# EAGLE design motorModule (EAGLE 8.0.2)
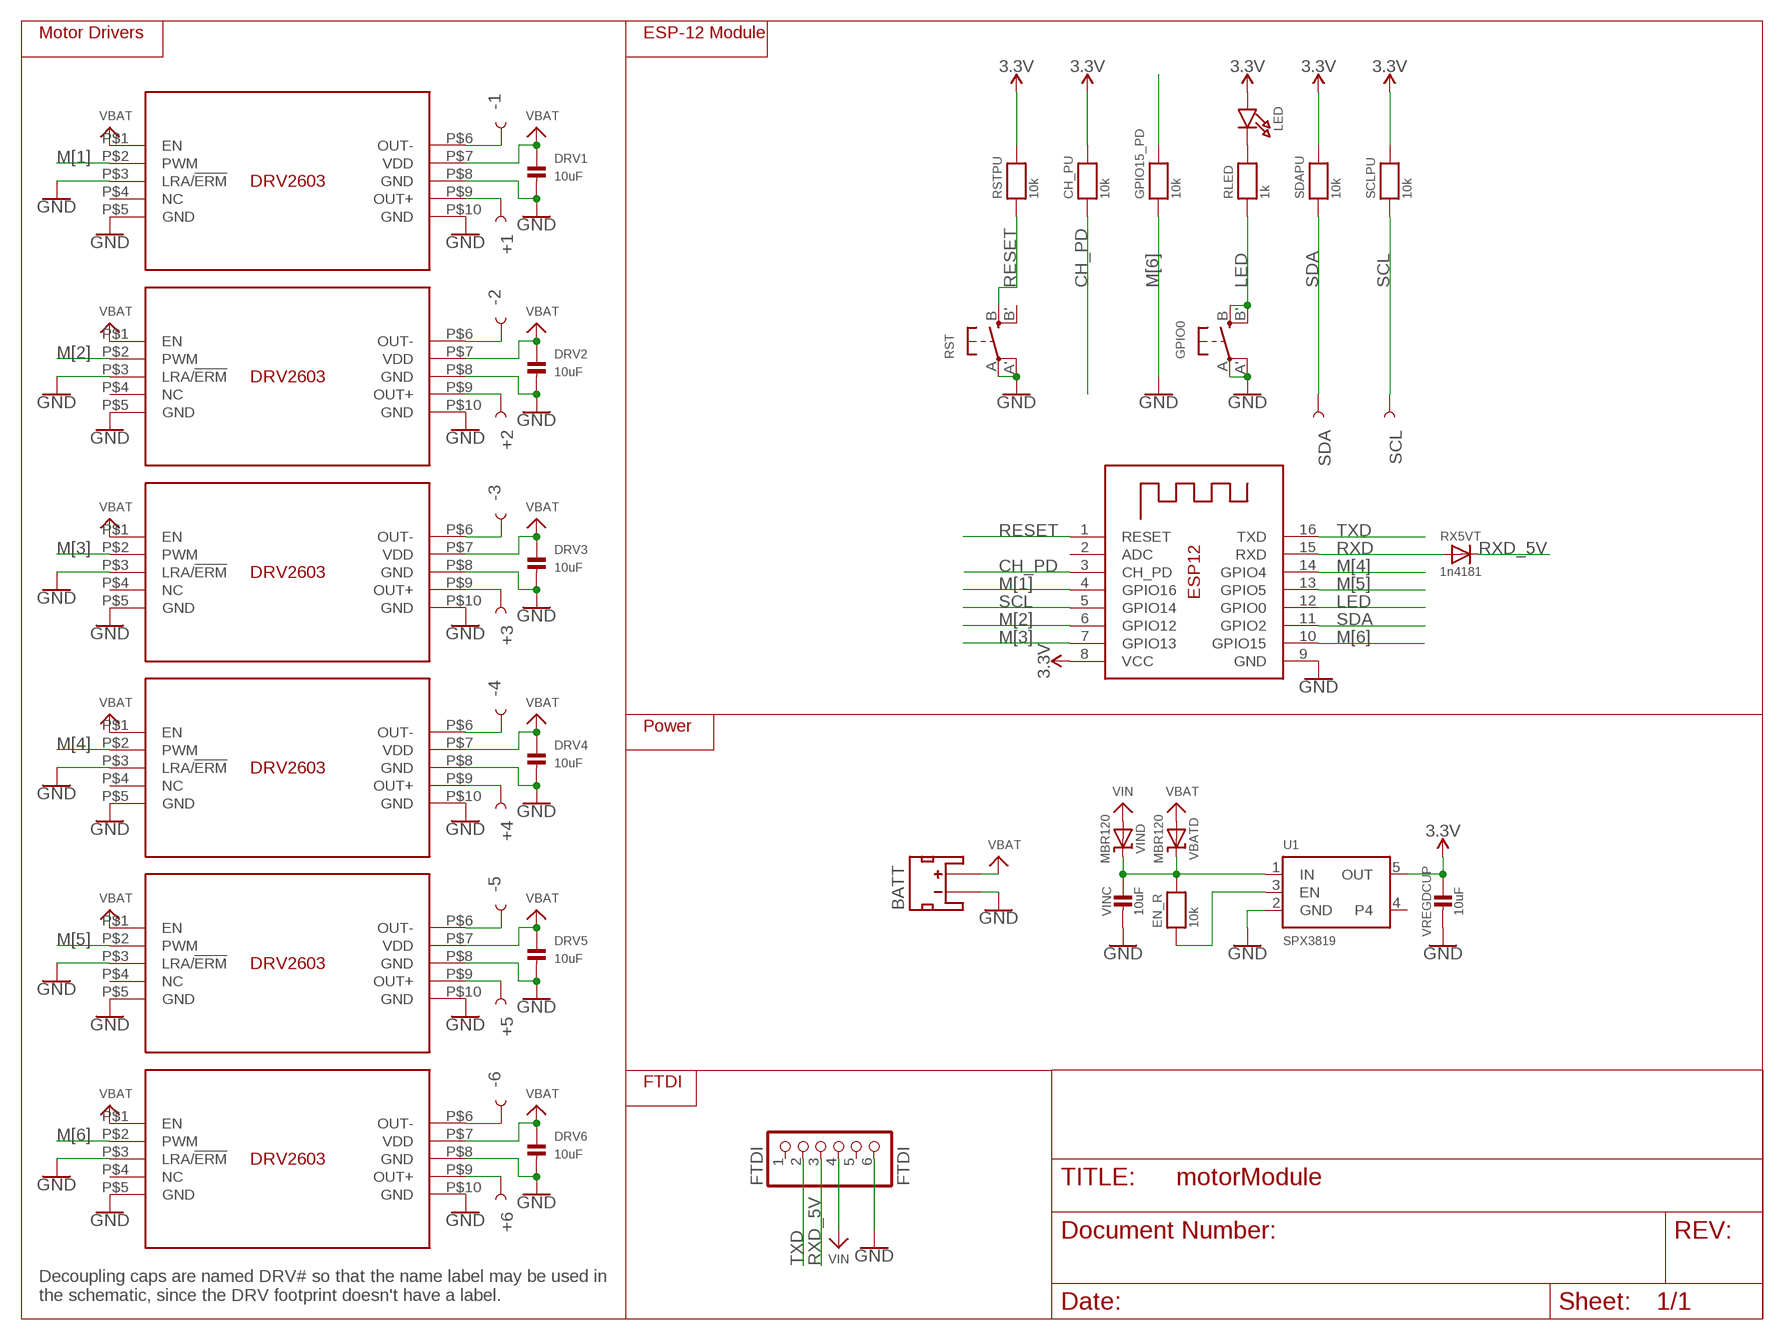
[diagram p0: schematic, sheet 1]

## Parts
+1  SEWTAP_SMALL-2SIDE  [PETAL-SMALL-2SIDE]
+2  SEWTAP_SMALL-2SIDE  [PETAL-SMALL-2SIDE]
+3  SEWTAP_SMALL-2SIDE  [PETAL-SMALL-2SIDE]
+4  SEWTAP_SMALL-2SIDE  [PETAL-SMALL-2SIDE]
+5  SEWTAP_SMALL-2SIDE  [PETAL-SMALL-2SIDE]
+6  SEWTAP_SMALL-2SIDE  [PETAL-SMALL-2SIDE]
-1  SEWTAP_SMALL-2SIDE  [PETAL-SMALL-2SIDE]
-2  SEWTAP_SMALL-2SIDE  [PETAL-SMALL-2SIDE]
-3  SEWTAP_SMALL-2SIDE  [PETAL-SMALL-2SIDE]
-4  SEWTAP_SMALL-2SIDE  [PETAL-SMALL-2SIDE]
-5  SEWTAP_SMALL-2SIDE  [PETAL-SMALL-2SIDE]
-6  SEWTAP_SMALL-2SIDE  [PETAL-SMALL-2SIDE]
BATT  JST_2MM_MALE  [JST-2-SMD]
CH_PU  10k  RESISTOR0603  [0603]
DRV1  10uF  CAP_CERAMIC0603  [0603]
DRV2  10uF  CAP_CERAMIC0603  [0603]
DRV3  10uF  CAP_CERAMIC0603  [0603]
DRV4  10uF  CAP_CERAMIC0603  [0603]
DRV5  10uF  CAP_CERAMIC0603  [0603]
DRV6  10uF  CAP_CERAMIC0603  [0603]
DRVIC1  DRV2603  [DRV2603]
DRVIC2  DRV2603  [DRV2603]
DRVIC3  DRV2603  [DRV2603]
DRVIC4  DRV2603  [DRV2603]
DRVIC5  DRV2603  [DRV2603]
DRVIC6  DRV2603  [DRV2603]
EN_R  10k  RESISTOR0603  [0603]
ESP12  ESP-12  [ESP-12]
FTDI  FTDI  PINHD-1X6  [1X06]
GPIO0  SWITCH_TACT_SMT4.6X2.8  [BTN_KMR2_4.6X2.8]
GPIO15_PD  10k  RESISTOR0603  [0603]
LED  MICROBUILDER_LED0805  [MICROBUILDER_CHIPLED_0805]
RLED  1k  RESISTOR0603  [0603]
RST  SWITCH_TACT_SMT4.6X2.8  [BTN_KMR2_4.6X2.8]
RSTPU  10k  RESISTOR0603  [0603]
RX5VT  1n4181  MICROBUILDER_DIODESOD-323  [MICROBUILDER_SOD-323]
SCL  SEWTAP_SMALL-2SIDE  [PETAL-SMALL-2SIDE]
SCLPU  10k  RESISTOR0603  [0603]
SDA  SEWTAP_SMALL-2SIDE  [PETAL-SMALL-2SIDE]
SDAPU  10k  RESISTOR0603  [0603]
U1  SPX3819  VREG_SOT23-5  [SOT23-5]
VBATD  MBR120  MICROBUILDER_DIODE-SCHOTTKYSOD-123  [MICROBUILDER_SOD-123]
VINC  10uF  MICROBUILDER_CAP_CERAMIC0805-NOOUTLINE  [MICROBUILDER_0805-NO]
VIND  MBR120  MICROBUILDER_DIODE-SCHOTTKYSOD-123  [MICROBUILDER_SOD-123]
VREGDCUP  10uF  MICROBUILDER_CAP_CERAMIC0805-NOOUTLINE  [MICROBUILDER_0805-NO]

## Nets
3.3V: CH_PU.2 ESP12.8(VCC) LED.A RSTPU.2 SCLPU.2 SDAPU.2 U1.5(OUT) VREGDCUP.1
CH_PD: CH_PU.1 ESP12.3(CH_PD)
GND: BATT.1(-) DRV1.2 DRV2.2 DRV3.2 DRV4.2 DRV5.2 DRV6.2 DRVIC1.P$3(LRA/!ERM) DRVIC1.P$5(GND) DRVIC1.P$8(GND) DRVIC1.P$10(GND) DRVIC2.P$3(LRA/!ERM) DRVIC2.P$5(GND) DRVIC2.P$8(GND) DRVIC2.P$10(GND) DRVIC3.P$3(LRA/!ERM) DRVIC3.P$5(GND) DRVIC3.P$8(GND) DRVIC3.P$10(GND) DRVIC4.P$3(LRA/!ERM) DRVIC4.P$5(GND) DRVIC4.P$8(GND) DRVIC4.P$10(GND) DRVIC5.P$3(LRA/!ERM) DRVIC5.P$5(GND) DRVIC5.P$8(GND) DRVIC5.P$10(GND) DRVIC6.P$3(LRA/!ERM) DRVIC6.P$5(GND) DRVIC6.P$8(GND) DRVIC6.P$10(GND) ESP12.9(GND) FTDI.6 GPIO0.A'(P1) GPIO0.A(P) GPIO15_PD.1 RST.A'(P1) RST.A(P) U1.2(GND) VINC.2 VREGDCUP.2
LDO_EN: EN_R.1 U1.3(EN)
LED: ESP12.12(GPIO0) GPIO0.B'(S1) GPIO0.B(S) RLED.1
LEDIN: LED.C RLED.2
M[1]: DRVIC1.P$2(PWM) ESP12.4(GPIO16)
M[2]: DRVIC2.P$2(PWM) ESP12.6(GPIO12)
M[3]: DRVIC3.P$2(PWM) ESP12.7(GPIO13)
M[4]: DRVIC4.P$2(PWM) ESP12.14(GPIO4)
M[5]: DRVIC5.P$2(PWM) ESP12.13(GPIO5)
M[6]: DRVIC6.P$2(PWM) ESP12.10(GPIO15) GPIO15_PD.2
N$4: -1.1 DRVIC1.P$6(OUT-)
N$5: +1.1 DRVIC1.P$9(OUT+)
N$6: -2.1 DRVIC2.P$6(OUT-)
N$7: +2.1 DRVIC2.P$9(OUT+)
N$8: -3.1 DRVIC3.P$6(OUT-)
N$9: +3.1 DRVIC3.P$9(OUT+)
N$10: -4.1 DRVIC4.P$6(OUT-)
N$11: +4.1 DRVIC4.P$9(OUT+)
N$12: -5.1 DRVIC5.P$6(OUT-)
N$13: +5.1 DRVIC5.P$9(OUT+)
N$14: -6.1 DRVIC6.P$6(OUT-)
N$15: +6.1 DRVIC6.P$9(OUT+)
RESET: ESP12.1(RESET) RST.B(S) RSTPU.1
RXD: ESP12.15(RXD) RX5VT.A
RXD_5V: FTDI.3 RX5VT.C
SCL: ESP12.5(GPIO14) SCL.1 SCLPU.1
SDA: ESP12.11(GPIO2) SDA.1 SDAPU.1
TXD: ESP12.16(TXD) FTDI.2
VBAT: BATT.2(+) DRV1.1 DRV2.1 DRV3.1 DRV4.1 DRV5.1 DRV6.1 DRVIC1.P$1(EN) DRVIC1.P$7(VDD) DRVIC2.P$1(EN) DRVIC2.P$7(VDD) DRVIC3.P$1(EN) DRVIC3.P$7(VDD) DRVIC4.P$1(EN) DRVIC4.P$7(VDD) DRVIC5.P$1(EN) DRVIC5.P$7(VDD) DRVIC6.P$1(EN) DRVIC6.P$7(VDD) VBATD.A
VIN: FTDI.4 VIND.A
VREGIN: EN_R.2 U1.1(IN) VBATD.C VINC.1 VIND.C
Unconnected: BATT.NC1(PAD1) BATT.NC2(PAD2) DRVIC1.P$4(NC) DRVIC2.P$4(NC) DRVIC3.P$4(NC) DRVIC4.P$4(NC) DRVIC5.P$4(NC) DRVIC6.P$4(NC) ESP12.2(ADC) FTDI.1 FTDI.5 RST.B'(S1) U1.4

## Notes on the sheet
- Motor Drivers | ESP-12 Module
- Power
- FTDI
- Decoupling caps are named DRV# so that the name label may be used in
  the schematic, since the DRV footprint doesn't have a label.

## Library data of the parts
+1-+6 -1--6 SCL SDA = LilyPad-Wearables:SEWTAP: SparkFun LilyPad Sew Taps Sewable connection points for LilyPad Boards SparkFun Products: LilyPad Arduino 328 Main Board <https://www.sparkfun.com/products/13342> LilyTiny <https://www.sparkfun.com/products/10899> LilyPad Power Supply <https://www.sparkfun.com/products/11259>
BATT = SparkFun-Connectors:JST_2MM_MALE: JST 2MM MALE RA CONNECTOR Two pin, compact surface mount connector. Commonly used as a battery input connection point. We really like the solid locking feeling and high current rating on these small connectors. We use these all the time as battery connectors. Mates to single-cell LiPo batteries. Here is the connector we sell at SparkFun: JST Right Angle Connector - White <https://www.sparkfun.com/products/8612> (PRT-08612) Datasheet <http://www.sparkfun.com/datasheets/Prototyping/Connectors/JST-Horizontal.pdf> It was used on these SparkFun products: SparkFun MOSFET Power Controller <https://www.sparkfun.com/products/11214> (PRT-11214) SparkFun Battery Babysitter - LiPo Battery Manager <https://www.sparkfun.com/products/13777> (PRT-13777) And many, many others that required a lipo battery connection.; PROD_ID: CONN-11443; SF_ID: PRT-08612
CH_PU EN_R GPIO15_PD RLED RSTPU SCLPU SDAPU = microbuilder:RESISTOR: Resistors 0402 - 0402 Surface Mount Package 22 Ohm 1% 1/16W [Digikey: 311-22.0LRTR-ND] 33 Ohm 5% 1/16W 1.0K 5% 1/16W 1.5K 5% 1/16W 2.0K 1% 1/16W 10.0K 1% 1/16W [Digikey: 311-10.0KLRTR-ND] 10.0K 5% 1/16W [Digikey: RMCF0402JT10K0TR-ND] 12.1K 1% 1/16W [Digikey: 311-22.0LRTR-ND] 100.0K 5% 1/16W 0603 - 0603 Surface Mount Package 0 Ohm 1/10 Watt 1% Resistor 15 Ohm 1/10 Watt 1% Resistor 33 Ohm 1/10 Watt 1% Resistor 49.9 Ohm 1/10 Watt 1% Resistor 100 Ohm 1/10 Watt 1% Resistor 150 Ohm 1/10 Watt 1% Resistor 240 Ohm 1/10 Watt 1% Resistor 390 Ohm 1/10 Watt 1% Resistor 560 Ohm 1/10 Watt 1% Resistor 680 Ohm 1/10 Watt 1% Resistor 750 Ohm 1/10 Watt 1% Resistor 1.0K Ohm 1/10 Watt 1% Resistor 1.5K Ohm 1/10 Watt 1% Resistor 2.0K Ohm 1/10 Watt 1% Resistor 2.2K Ohm 1/10 Watt 1% Resistor 3.3K Ohm 1/10 Watt 1% Resistor 4.7K Ohm 1/10 Watt 1% Resistor 10.0K Ohm 1/10 Watt 1% Resistor 12.0K Ohm 1/10 Watt 1% Resistor 12.1K Ohm 1/10 Watt 1% Resistor 20.0K Ohm 1/10 Watt 1% Resistor 33.0K Ohm 1/10 Watt 1% Resistor 100.0K Ohm 1/10 Watt 1% Resistor 0805 - 0805 Surface Mount Package 0 Ohm 1/8 Watt 1% Resistor 33 Ohm 1/8 Watt 1% Resistor 100 Ohm 1/8 Watt 1% Resistor 150 Ohm 1/8 Watt 1% Resistor 200 Ohm 1/8 Watt 1% Resistor 240 Ohm 1/8 Watt 1% Resistor 330 Ohm 1/8 Watt 1% Resistor 390 Ohm 1/8 Watt 1% Resistor 470 Ohm 1/8 Watt 1% Resistor 1.0K Ohm 1/8 Watt 1% Resistor 1.5K Ohm 1/8 Watt 1% Resistor 2.0K Ohm 1/8 Watt 1% Resistor 4.7K Ohm 1/8 Watt 1% Resistor 5.1K Ohm 1/8 Watt 1% Resistor 5.6K Ohm 1/8 Watt 1% Resistor 10.0K Ohm 1/8 Watt 1% Resistor 22.0K Ohm 1/8 Watt 1% Resistor 33.0K Ohm 1/8 Watt 1% Resistor 100K Ohm 1/8 Watt 1% Resistor 1206 - 1206 Surface Mount Package 2012 - 2010 Surface Mount Package 0.11 Ohm 1/2 Watt 1% Resistor - Digikey: RHM.11UCT-ND
DRV1-DRV6 = microbuilder:CAP_CERAMIC: Ceramic Capacitors 0402 - 0402 Surface Mount Capacitors 16pF 50V 5% [Digikey: 445-4899-2-ND] 18pF 50V 5% [Digikey: 490-1281-2-ND] 22pF 50V 5% [Digikey: 490-1283-2-ND] 68pF 50V 5% [Digikey: 490-1289-2-ND] 0.1uF 10V 10% [Digikey: 490-1318-2-ND] 1.0uF 6.3V 10% [Digikey: 490-1320-2-ND] 0603 - 0603 Surface Mount Capacitors 16 pF 50V 5% [Digikey: 445-5051-2-ND] 22 pF 50V [Digikey: PCC220ACVTR-ND] 33 pF 50V 5% [Digikey: 490-1415-1-ND] 56pF 50V 5% [Digikey: 490-1421-1-ND] 220pF 50V 5% [Digikey: 445-1285-1-ND] 680 pF 50V 2200 pF 50V 5% C0G [Digikey: 445-1297-1-ND] 5600 pF 100V 5% X7R [Digikey: 478-3711-1-ND] 0.1 µF 25V 10% [Digikey: PCC2277TR-ND] 0.22 µF 16V 10% X7R [Digikey: 445-1318-1-ND] 1.0 µF 25V 10% [Digikey: 445-5146-2-ND] 0603 - RF Specific 3pF 250V +/-0.1pF RF [Digikey: 712-1347-1-ND] 18 pF 250V 5% [Digikey: 478-3505-1-ND or 712-1322-1-ND] 56 pF 250V 5% C0G RF [Digikey: 490-4867-1-ND] 68 pF 250V RF [Digikey: 490-4868-1-ND] 0805 - 0805 Surface Mount Capacitors 220 pF 250V 2% RF Ceramic Capacitor [Digikey: 712-1398-1-ND] 1000 pF 50V 2% NP0 Ceramic Capacitor [Digikey: 478-3760-1-ND] 0.1 µF 25V 10% Ceramic Capacitor [Digikey: PCC1828TR-ND] 1.0 µF 16V 10% Ceramic Capacitor[Digikey: 490-1691-2-ND] 10.0 µF 10V 10% Ceramic Capacitor[Digikey: 709-1228-1-ND] 10.0 uF 16V 10% Ceramic Capacitor [Digikey: 478-5165-2-ND] 47 uF 6.3V 20% Ceramic Capacitor [Digikey: 587-1779-1-ND or 399-5506-1-ND] 1206 - 1206 Surface Mount Capacitors 47uF 10V 20% Ceramic Capacitor [Digikey: 490-5528-1-ND or 399-5508-1-ND or 445-6010-1-ND] 100uF 6.3V -20%, +80% Y5V Ceramic Capacitor (Digikey: 490-4512-1-ND, Mouser: 81-GRM31CF50J107ZE1L)
DRVIC1-DRVIC6 = DRV2603:DRV2603
ESP12 = adafruit:ESP-12
FTDI = pinhead:PINHD-1X6: PIN HEADER
GPIO0 RST = microbuilder:SWITCH_TACT_SMT: SMT Tact Switches 6x6mm - Digikey: P12940SCT-ND KMR2 (4.6x2.8mm) - Digikey: 401-1426-1-ND EVQ-PQHB55 - Light Touch, 160GF (4.5x4.5mm) - Digikey: P8090SCT-ND
LED = Adafruit HUZZAH ESP8266 Basic Breakout:MICROBUILDER_LED: LED 0603 - 0603 Surface Mount Package 2mA: Green LED - Low Power (3.9mcd, 2ma, 1.7Vf) - Digikey: 475-2709-2-ND Orange LED - Low Power (9.8mcd, 2ma, 1.8Vf) - Digikey: 475-1194-2-ND Red LED - Low Power (5mcd, 2ma, 1.8Vf) - Digikey: 475-1195-2-ND Yellow LED - Low Power (7mcd, 2ma, 1.8Vf) - Digikey: 475-1196-2-ND 5mA: Blue LED - Low Power (17mcd, 5ma, 2.9Vf) - Digikey: LNJ937W8CRACT-ND 0805 - 0805 Surface Mount Package 2mA: Red LED (8.8mcd, 2mA, 1.8Vf, Clear) - Low Power [Digikey: 475-2510-1-ND] Green LED (5mcd, 2mA, 1.8Vf, Clear) - Low Power [Digikey: 475-2730-1-ND] Yellow LED (11.3mcd, 2mA, 1.8Vf, Clear) - Low Power [Digikey: 475-2555-1-ND] 20mA: Red LED (104mcd, 20mA, Diffused) - LS R976 [Digikey: 475-1278-6-ND] Red LED (12mcd, 20mA, 2.0Vf, Clear) - APT2012EC [Digikey: 754-1128-1-ND] Green LED (15mcd, 20mA, 2.2Vf, Clear) - APT2012GC [Digikey: 754-1131-1-ND] Orange LED (160mcd, 20mA, 2.1Vf, Clear) - APT2012SECK [Digikey: 754-1130-1-ND] 1206 - 1206 Surface Mount Package Green LED (26mcd, 20mA, Diffused) - LG N971 [Digikey: 475-1407-6-ND] Red LED (15mcd, 20mA, Diffused) - LH N974 [Digikey: 475-1416-6-ND] Cree - Cree High-Power Surface Mount LEDs XPEBWT-L1-0000-00D50 - White 111lm 350mA 2.9Vf 6200K 110° XTEAWT-00-0000-00000LEE3 - White 114lm 350mA 2.85Vf 5000K 115° Everlight - Everlight 45-21 Series Surface Mount LEDs 45-21/QK2C-B2832AC2CB2/2T - Warm White 2000mcd 20mA 3.25Vf 3050K 120° 45-21/LK2C-B38452C4CB2/2T - Nuetral White 2000mcd 20mA 3.25Vf 4150K 120° 45-21/LK2C-B50634C6CB2/2T - Cold White 2200mcd 20mA 3.25Vf 5650K 120° PLCC2 Reverse Mount LS T77K-J1L2-1-0-2-R18-Z - Red 11.25mcd 2mA 1.8Vf 630nm 120° LO T77K-L1M2-24-Z - Orange 19.6mcd 2mA 1.8Vf 606nm 120° LY T77K-K2M1-26-Z - Yellow 15.7mcd 2mA 1.8Vf 587nm 120°
RX5VT = Adafruit HUZZAH ESP8266 Basic Breakout:MICROBUILDER_DIODE: Diode SMA Model Volts Amps Type Vf Ir Digikey # Notes SSA34-E3 40V 3A Schottky 480mV @ 3A 200uA @ 40V SSA34-E3/61TGITR-ND CDBA120-G 20V 1A Schottky 500mV @ 1A 500uA @ 20V 641-1014-6-ND REEL MBRA210 10V 2A Schottky 350mV @ 2A 700uA @ 10V MBRA210LT3 SOD-123 Model Volts Amps Type Vf Ir Order # Notes BAT54T1G 30V 200mA Schottky 800mV @ 200mA 2uA @ 25V BAT54T1GOSTR-ND B0530W 30V 500mA Schottky 430mV @ 500mA 130uA @ 30V B0530W-FDICT-ND REEL MBR120 20V 1A Schottky 340mV @ 1A MBR120VLSFT1GOSCT-ND SOD-323 Model Volts Amps Type Vf Ir Order # Notes PMEG2005EJ 20V 500mA Schottky 355mV @ 500mA 568-4110-1-ND ZLLS410 10V 570mA Schottky 380mV @ 570mA ZLLS410CT-ND 1N4148WS 75V 150mA Silicon/Simple 1V 1N4148WSFSCT-ND REEL SOD-523 Model Volts Amps Type Vf Ir Order # Notes BAT54XV2 30V 200mA Schottky 0.8V @ 100mA BAT54XV2CT-ND TB751S 30V 30mA Schottky RB751S-40TE61CT-ND SOT23-R/W (R = Solder Paste/Reflow Ovens, W = Hand-Soldering) Model Volts Amps Type Vf Ir Order # Notes BAT54FILM 40V 300mA Schottky 497-7162-1-ND POWERDI-5 Model Volts Amps Type Vf Ir Order # Notes PDS560 60V 5A Schottky 670mV @ 5A 150uA @ 60V PDS560DICT-ND
U1 = microbuilder:VREG_SOT23-5: SOT23-5 Fixed Voltage Regulators To better organise some of the SOT23-5 fixed voltage regulators in this library, this new part was created. Part Current Out V Out V In V Dropout Digikey Part No. ADP121 150mA 3.3V 3.4-5.5V 0.09V @ 150mA ADP121-AUJZ33R7CT-ND ADP121 150mA 3.0V 3.1-5.5V 0.09V @ 150mA ADP121-AUJZ30R7CT-ND ADP122 300mA 3.3V 3.4-5.5V 0.085V @ 300mA ADP122AUJZ-3.3-R7CT-ND ADP1712 300mA 3.3V 3.5-5.5V 0.17V @ 300mA ADP1712AUJZ-3.3-R7TR-ND AP7311 (Low Cost) 150mA 3.3V 3.5-6V 0.15V @ 150mA AP7311-33WG-7DICT-ND LD39015M18R 150mA 1.8V 1.9V-5.5V 0.08V @ 100mA 497-6977-1-ND MCP1824T-3302E/OT 300mA 3.3V 3.5V-6V 0.2V @ 300mA MCP1824T-3302E/OTCT-ND MIC5205-2.5YM5 TR 150mA 2.5V 2.7-16V 0.165V @ 150mA 576-1257-2-ND MIC5205-3.0YM5 TR 150mA 3.0V 3.2V-16V 0.165V @ 150mA 576-1258-2-ND MIC5205-3.3YM5 TR 150mA 3.3V 3.5V-16V 0.165V @ 150mA 576-1259-2-ND TPS780330220 150mA 3.3V+2.2V 3.6-5.5V 250mV Max 296-23332-1-ND TDA3663/N1,135 100mA 3.3V 3.5-45V 0.18V @ 50mA 568-5343-1-ND
VBATD VIND = Adafruit HUZZAH ESP8266 Basic Breakout:MICROBUILDER_DIODE-SCHOTTKY
VINC VREGDCUP = Adafruit HUZZAH ESP8266 Basic Breakout:MICROBUILDER_CAP_CERAMIC: Ceramic Capacitors For new designs, use the packages preceded by an '_' character since they are more reliable: The following footprints should be used on most boards: _0402 - Standard footprint for regular board layouts _0603 - Standard footprint for regular board layouts _0805 - Standard footprint for regular board layouts _1206 - Standard footprint for regular board layouts For extremely tight-pitch boards where space is at a premium, the following 'micro-pitch' footprints can be used (smaller pads, no silkscreen outline, etc.): _0402MP - Micro-pitch footprint for very dense/compact boards _0603MP - Micro-pitch footprint for very dense/compact boards _0805MP - Micro-pitch footprint for very dense/compact boards _1206MP - Micro-pitch footprint for very dense/compact boards

## Board
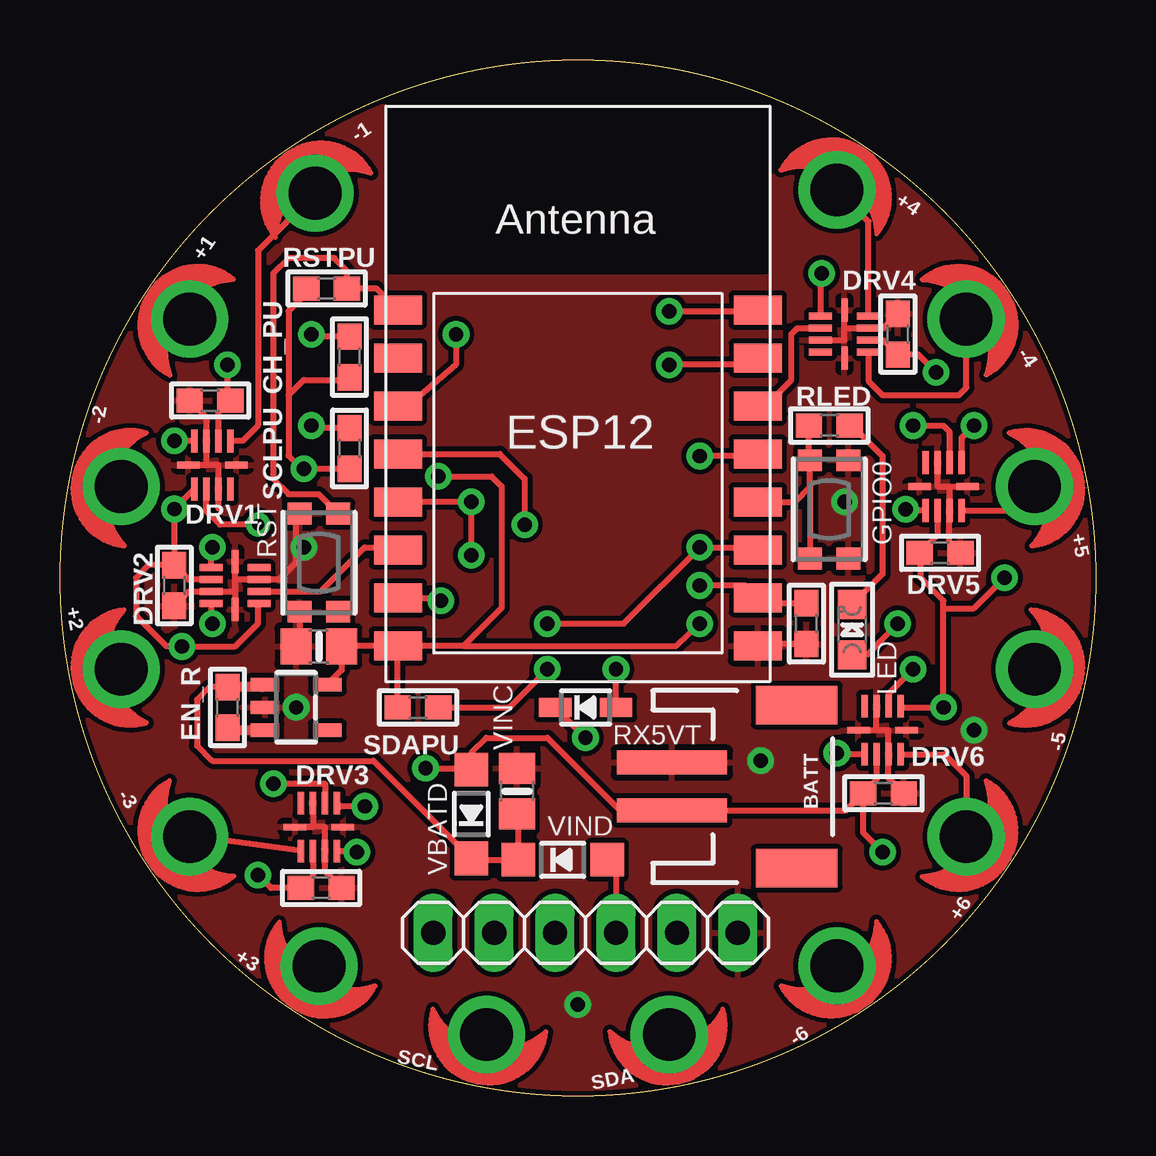
[diagram p1: board, top side]
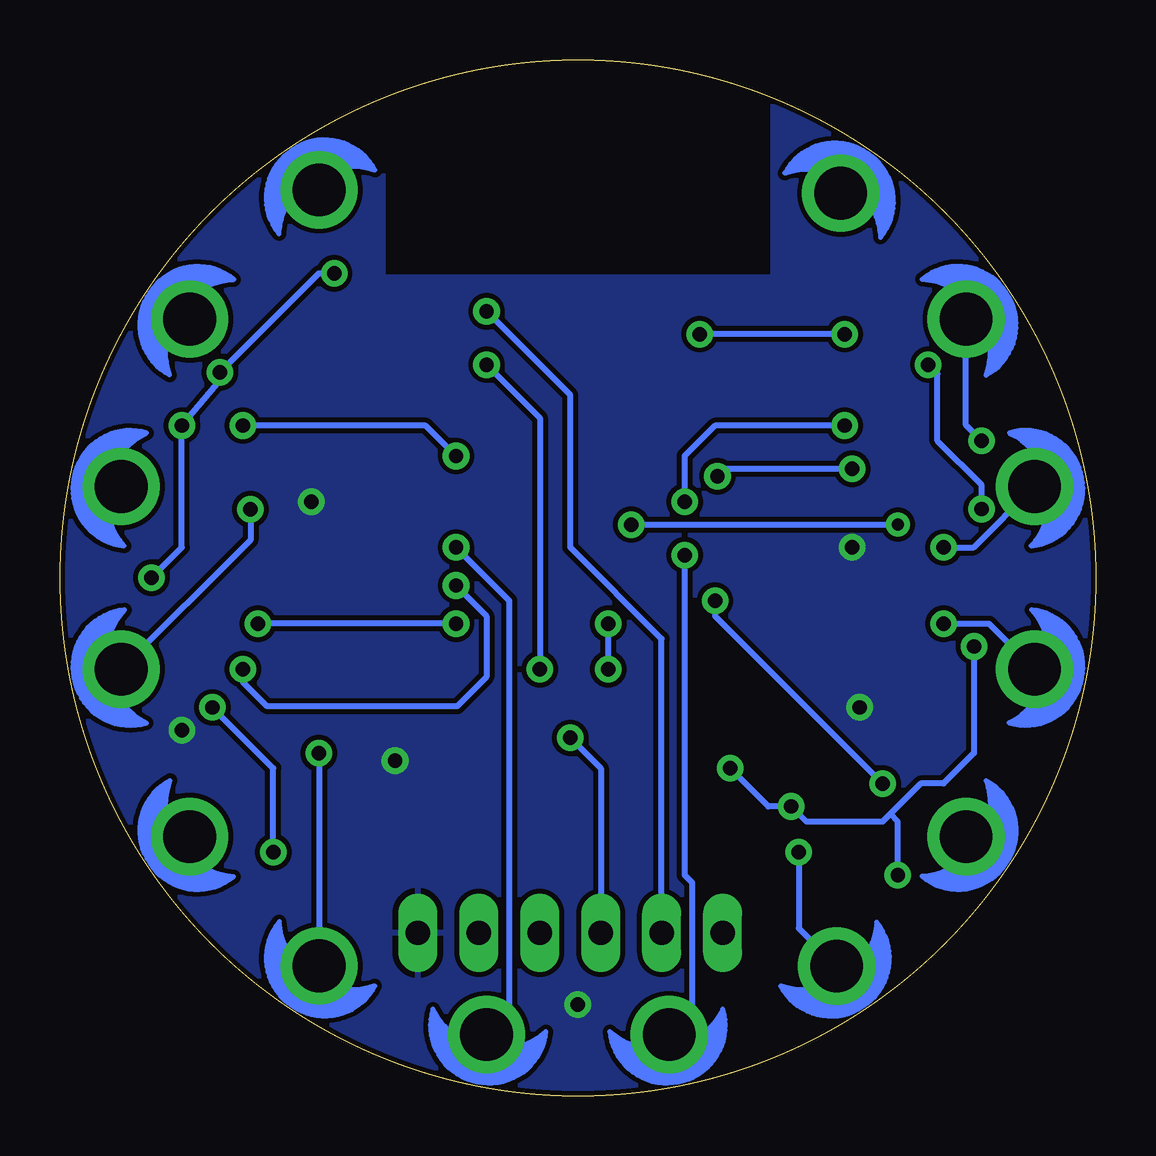
[diagram p2: board, bottom side, seen from below]

Size 43.18 x 43.18 mm. Coordinates in mm from the lower left corner, seen from the top.
Outline: circle at 21.59,21.59 radius 21.59
Copper layers (1*16): Top 0.035mm / dielectric 1.5mm / Bottom 0.035mm
Design rules "SparkFun": minimum track width 8mil, minimum drill 20mil, track to track 8mil, track to pad 8mil, pad to pad 8mil, via to via 8mil, smd to smd 8mil, copper to edge 8mil, drill to drill 8mil, minimum pad ring 12mil, minimum via ring 10mil, stop-mask expansion 4mil, vias tented up to drill 20mil, thermal gap 10mil

### Footprints (pad centres in the part's own frame; a part is rotated, then mirrored left to right if it is on the bottom)
PETAL-SMALL-2SIDE = drill 2.2: 1 0,0
JST-2-SMD = smd 1 x 4.6: 1 -1,-3.7; 2 1,-3.7 | smd 1.6 x 3.4: NC1 -3.4,1.5; NC2 3.4,1.5
0603 = smd 1.1 x 1: 1 -0.85,0; 2 0.85,0
DRV2603 = smd 0.28 x 0.95: P$1 -0.75,-1; P$2 -0.25,-1; P$3 0.25,-1; P$4 0.75,-1; P$6 0.75,1; P$7 0.25,1; P$8 -0.25,1; P$9 -0.75,1 | smd 0.95 x 0.28: P$5 1,0; P$10 -1,0
ESP-12 = smd 2 x 1.2: 1 -7.5,4.5; 2 -7.5,2.5; 3 -7.5,0.5; 4 -7.5,-1.5; 5 -7.5,-3.5; 6 -7.5,-5.5; 7 -7.5,-7.5; 8 -7.5,-9.5; 9 7.5,-9.5; 10 7.5,-7.5; 11 7.5,-5.5; 12 7.5,-3.5; 13 7.5,-1.5; 14 7.5,0.5; 15 7.5,2.5; 16 7.5,4.5
1X06 = drill 1.016 long: 1 -6.35,0; 2 -3.81,0; 3 -1.27,0; 4 1.27,0; 5 3.81,0; 6 6.35,0
BTN_KMR2_4.6X2.8 = smd 0.9 x 1: A 2.05,0.8; A' -2.05,0.8; B 2.05,-0.8; B' -2.05,-0.8
MICROBUILDER_CHIPLED_0805 = smd 1.2 x 1.2: A 0,-1.05; C 0,1.05
MICROBUILDER_SOD-323 = smd 1.35 x 0.8: A 1.27,0; C -1.27,0
SOT23-5 = smd 0.55 x 1.2: 1 -0.95,-1.3; 2 0,-1.3; 3 0.95,-1.3; 4 0.95,1.3; 5 -0.95,1.3
MICROBUILDER_SOD-123 = smd 1.4 x 1.4: A 1.85,0; C -1.85,0
MICROBUILDER_0805-NO = smd 1.3 x 1.5: 1 -0.95,0; 2 0.95,0

### Placement (x,y rotation side)
+1  5.41,32.37 236.5 top
+2  2.56,17.79 281.3 top
+3  10.81,5.41 326.5 top
+4  32.38,37.76 146.5 top
+5  40.62,25.39 101.3 top
+6  37.77,10.81 56.5 top
-1  10.64,37.63 213.9 top
-2  2.56,25.39 259.1 top
-3  5.41,10.81 303.9 top
-4  37.77,32.37 123.9 top
-5  40.62,17.79 79.1 top
-6  32.38,5.42 33.9 top
BATT  29.21,12.89 270 top
CH_PU  12.07,30.8 270 top
DRV1  6.26,28.99 180 top
DRV2  4.76,21.27 270 top
DRV3  10.89,8.67 0 top
DRV4  34.92,31.75 90 top
DRV5  36.68,22.63 0 top
DRV6  34.33,12.61 0 top
DRVIC1  6.35,26.3 0 top
DRVIC2  7.3,21.27 90 top
DRVIC3  10.79,11.2 180 top
DRVIC4  32.7,31.75 270 top
DRVIC5  36.83,25.4 180 top
DRVIC6  34.29,15.24 180 top
EN_R  6.99,16.19 90 top
ESP12  21.59,28.26 0 top
FTDI  21.91,6.79 0 top
GPIO0  32.07,24.45 270 top
GPIO15_PD  31.11,19.68 90 top
LED  33.02,19.43 0 top
RLED  32.07,27.94 0 top
RST  10.79,22.23 90 top
RSTPU  11.11,33.66 180 top
RX5VT  21.91,16.19 0 top
SCL  17.79,2.56 348.8 top
SCLPU  12.07,26.99 270 top
SDA  25.39,2.56 11.3 top
SDAPU  14.92,16.19 180 top
U1  9.84,16.19 270 top
VBATD  17.14,11.75 90 top
VINC  19.05,12.7 90 top
VIND  20.96,9.84 0 top
VREGDCUP  10.79,18.73 180 top

### Tracks (layer width: path | path; a pad name or v marks a point on that pad's centre or on a via)
3.3V  (via drill 0.6)
  Top 0.254: SDAPU.2 14.07,18.74 ESP12.8 | ESP12.8 11.77,18.76 VREGDCUP.1 11.75,17.75 U1.5 | 16.83,18.76 ESP12.8 | 16.83,18.76 25.69,18.76 v26.67,19.68 | v34.92,19.68 33.69,18.41 LED.A | SCLPU.2 v10.16,26.14 10.06,26.14 9.53,26.67 9.53,29.21 | 9.53,29.21 10.16,29.84 11.96,29.84 CH_PU.2 | 9.84,33.23 RSTPU.2 10.26,33.44 9.53,32.7 9.53,29.21 | v15.77,25.82 18,25.82 18.41,25.4 18.41,20.34 16.83,18.76
  Bottom 0.254: v26.67,19.68 v34.92,19.68 | v10.16,26.14 15.46,26.14 v15.77,25.82
CH_PD  (via drill 0.6)
  Top 0.254: CH_PU.1 10.58,31.65 v10.48,31.75 | v16.51,31.75 16.51,30.48 14.27,28.57 ESP12.3
  Bottom 0.254: v10.48,31.75 v16.51,31.75
GND  (via drill 0.6)
  Top 0.254: DRV3.2 11.04,9.36 DRVIC3.P$8 11.04,11.2 DRVIC3.P$5 10.54,11.2 DRVIC3.P$3 | DRV2.2 5.36,21.02 DRVIC2.P$8 7.3,21.02 DRVIC2.P$5 | DRV1.2 6.1,28.29 DRVIC1.P$8 6.1,26.3 DRVIC1.P$10 6.6,26.3 DRVIC1.P$3 6.6,24.49 | RST.A' 10,18.88 VREGDCUP.2 | RST.A 9.84,24.12 9.84,22.23 9.14,21.52 DRVIC2.P$3 7.3,21.52 DRVIC2.P$10 | GPIO15_PD.1 29.17,18.84 ESP12.9 | DRV4.2 34.33,32 DRVIC4.P$8 32.7,32 | DRV5.2 37.08,23.09 DRVIC5.P$8 37.08,25.4 | DRV6.2 34.54,13.25 DRVIC6.P$8 34.54,15.24 34.04,15.24 | 34.04,15.24 DRVIC6.P$5 | 34.04,15.24 DRVIC6.P$3 | 37.08,25.4 DRVIC5.P$10 | DRVIC5.P$3 36.58,25.4 37.08,25.4 | 32.7,32 DRVIC4.P$10 | DRVIC4.P$3 32.7,31.5 32.7,32
  other vias: 32.7,24.77 9.84,16.19 38.1,15.24 29.21,13.97 10.16,22.86 21.59,3.81
  pour Bottom: 21.59,44.45 arc90 -1.27,21.59 arc90 21.59,-1.27 arc90 44.45,21.59 44.45,22.86 arc90 22.86,44.45
  pour Top: 21.59,44.45 arc90 -1.27,21.59 arc90 21.59,-1.27 arc90 44.45,21.59 arc90
LDO_EN
  Top 0.254: 7.09,15.24 EN_R.1
  Top 0.406: U1.3 7.09,15.24
LED
  Top 0.254: 31.27,25.4 GPIO0.B | 31.27,25.4 GPIO0.B' 31.22,26.55 RLED.1 | ESP12.12 30.62,24.76 31.27,25.4
LEDIN
  Top 0.254: RLED.2 33.02,27.94 34.29,26.67 34.29,21.75 LED.C
M[1]  (via drill 0.5, 0.6)
  Top 0.254: ESP12.4 18.33,26.76 19.37,25.72 v19.37,23.81 | v8.26,23.81 6.67,23.81 6.1,24.38 DRVIC1.P$2
  Bottom 0.254: v19.37,23.81 v8.26,23.81
M[2]
  Top 0.254: DRVIC2.P$2 10.86,21.02 12.7,22.86 13.99,22.86 ESP12.6
M[3]  (via drill 0.6)
  Top 0.254: ESP12.7 15.75,20.76 v15.88,20.64 | v8.89,13.02 11.04,13.02 DRVIC3.P$2
  Bottom 0.254: v15.88,20.64 15.88,20 v8.89,13.02
M[4]
  Top 0.254: ESP12.14 29.39,28.76 30.48,29.84 30.48,31.75 30.73,32 DRVIC4.P$2
M[5]  (via drill 0.6)
  Top 0.254: ESP12.13 29,26.67 v26.67,26.67 | v35.56,27.94 36.83,27.94 37.08,27.69 DRVIC5.P$2
  Bottom 0.254: v26.67,26.67 27.94,27.94 v35.56,27.94
M[6]  (via drill 0.6)
  Top 0.254: GPIO15_PD.2 29.31,20.54 ESP12.10 28.57,21.27 v26.67,21.27 | v35.56,17.78 34.54,16.76 DRVIC6.P$2
  Bottom 0.254: v26.67,21.27 25.4,20 25.4,17.46 26.62,16.24 DRVIC6.P$2 35.56,17.26 v35.56,17.78
N$4
  Top 0.254: -1.1 8.26,35.24 8.26,27.94 7.61,27.3 DRVIC1.P$6
N$5  (via drill 0.6)
  Top 0.254: DRVIC1.P$9 v4.76,27.3
  Bottom 0.254: v4.76,27.3 5.41,27.95 +1.1
N$6  (via drill 0.6)
  Top 0.254: DRVIC2.P$6 6.3,22.81 v6.35,22.86
  Bottom 0.254: v6.35,22.86 5.09,22.86 -2.1
N$7  (via drill 0.6)
  Top 0.254: DRVIC2.P$9 6.3,19.73 v6.35,19.68
  Bottom 0.254: v6.35,19.68 4.46,19.68 +2.1
N$8
  Top 0.254: DRVIC3.P$6 5.44,10.84 -3.1
N$9  (via drill 0.6)
  Top 0.254: DRVIC3.P$9 12.34,10.2 v12.38,10.16
  Bottom 0.254: v12.38,10.16 12.38,6.99 +3.1
N$10
  Top 0.254: DRVIC4.P$6 33.7,29.8 34.29,29.21 37.47,29.21 37.78,29.53 37.78,32.36 -4.1
N$11
  Top 0.254: DRVIC4.P$9 33.7,36.44 +4.1
N$12  (via drill 0.6)
  Top 0.254: DRVIC5.P$6 35.29,24.4 v35.24,24.45
  Bottom 0.254: v35.24,24.45 35.24,23.17 -5.1
N$13
  Top 0.254: DRVIC5.P$9 39.63,24.4 +5.1
N$14  (via drill 0.6)
  Top 0.254: DRVIC6.P$6 32.43,14.24 v32.39,14.29
  Bottom 0.254: v32.39,14.29 -6.1
N$15
  Top 0.254: DRVIC6.P$9 36.88,14.24 37.78,13.34 37.78,10.82 +6.1
RESET
  Top 0.254: ESP12.1 13.19,33.66 RSTPU.1 11.96,34.39 11.43,34.92 9.53,34.92 8.89,34.29 8.89,25.72 9.53,25.08 10.79,25.08 RST.B
RXD  (via drill 0.6)
  Top 0.254: ESP12.15 28.81,30.48 v25.4,30.48 | RX5VT.A v23.18,17.78
  Bottom 0.254: v25.4,30.48 23.18,28.26 v23.18,17.78
RXD_5V  (via drill 0.6)
  Top 0.254: RX5VT.C v21.91,14.92
  Bottom 0.254: v21.91,14.92 20.64,13.65 FTDI.3
SCL  (via drill 0.6)
  Top 0.254: SCLPU.1 10.58,27.84 v10.48,27.94 | ESP12.5 v17.14,24.77 v17.14,22.54
  Bottom 0.254: v10.48,27.94 15.88,27.94 17.14,26.67 v17.14,24.77 | SCL.1 16.83,3.52 16.83,8.89 17.14,9.21 v17.14,22.54
SDA  (via drill 0.6)
  Top 0.254: ESP12.11 28.99,22.86 v26.67,22.86 23.5,19.68 v20.32,19.68 | SDAPU.1 18.73,16.19 v20.32,17.78
  Bottom 0.254: SDA.1 24.45,3.5 24.45,20.64 v26.67,22.86 | v20.32,17.78 v20.32,19.68
TXD  (via drill 0.6)
  Top 0.254: v25.4,32.7 29.04,32.7 ESP12.16
  Bottom 0.254: FTDI.2 18.1,19.05 21.91,22.86 21.91,29.21 v25.4,32.7
VBAT  (via drill 0.6)
  Top 0.254: DRVIC3.P$7 10.54,9.17 DRV3.1 8.8,8.67 v8.26,9.21 | v12.7,12.07 11.68,12.07 DRVIC3.P$1 | DRVIC2.P$7 5.36,21.52 DRV2.1 | DRV2.1 3.71,22.12 3.18,21.59 3.18,20 4.45,18.73 v5.08,18.73 7.3,18.73 8.26,19.68 8.26,20.48 DRVIC2.P$1 | DRVIC1.P$7 6.6,28.48 DRV1.1 6.99,29.11 v6.99,30.48 | DRVIC1.P$1 v4.76,24.46 DRV2.1 | v15.24,13.65 17.09,13.65 VBATD.A 17.14,14.29 17.78,14.92 20.32,14.92 23.5,11.75 25.37,11.75 BATT.2 32.76,11.89 DRV6.1 | DRVIC4.P$7 34.33,31.5 DRV4.1 35.78,30.9 v36.51,30.16 | DRVIC5.P$7 36.58,23.38 DRV5.1 35.88,22.59 35.88,21.59 36.83,20.64 36.83,20.32 | DRVIC6.P$7 34.04,13.17 DRV6.1 | DRV6.1 33.48,10.97 v34.29,10.16 | DRVIC6.P$1 35.09,16.19 v36.83,16.19 36.83,20.32 | 36.83,20.32 38.1,20.32 v39.37,21.59 | v38.1,27.94 37.58,27.42 DRVIC5.P$1 | v31.75,34.29 31.7,34.24 DRVIC4.P$1
  Bottom 0.254: v15.24,13.65 13.65,12.07 v12.7,12.07 12.07,11.43 8.89,11.43 8.57,11.75 | v4.76,24.46 4.76,25.46 DRVIC1.P$7 6.6,30.09 v6.99,30.48 | v5.08,18.73 5.08,14.29 6.35,13.02 7.3,13.02 8.57,11.75 | v34.29,10.16 34.29,13.65 v36.83,16.19 | v39.37,21.59 38.1,22.86 v38.1,27.94 36.51,29.84 v36.51,30.16 32.39,34.29 v31.75,34.29 | v8.26,9.21 8.26,11.43 8.57,11.75
VIN
  Top 0.254: VIND.A 23.18,9.47 FTDI.4
VREGIN
  Top 0.254: VINC.1 19.11,11.7 VIND.C 17.2,9.84 VBATD.C 13.07,13.97 6.35,13.97 5.72,14.61 5.72,16.51 6.25,17.04 EN_R.2 | 8.44,17.04 U1.1
  Top 0.406: 8.44,17.04 EN_R.2